# EAGLE design Lifting Mechanism (EAGLE 7.2.0)
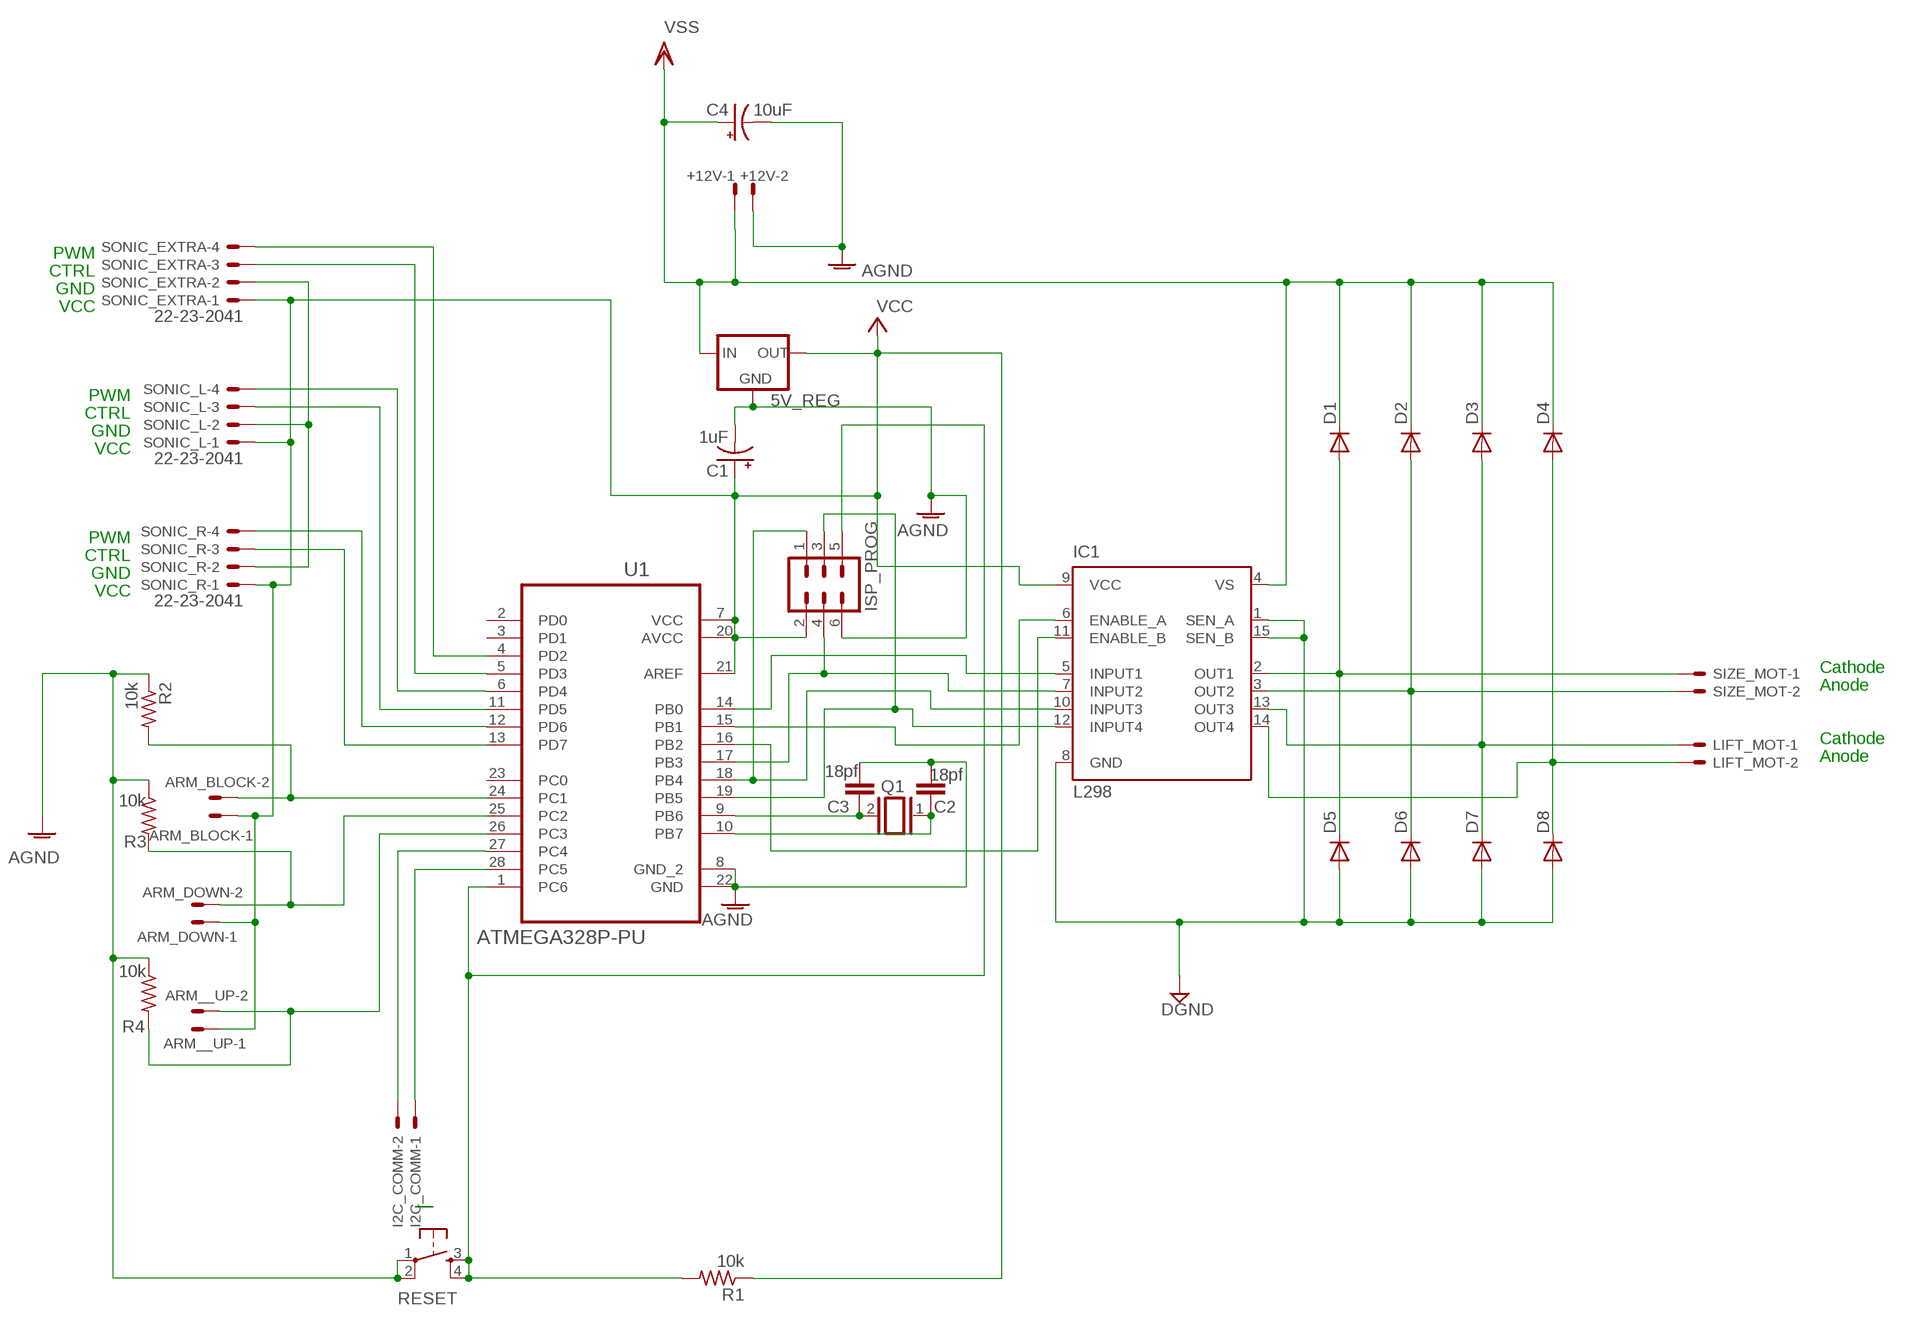
[diagram p0: schematic, sheet 1]

## Parts
5V_REG  V_REG_78XXSINK  [TO220-IGO]
+12V  22-23-2021  [22-23-2021]
ARM__UP  22-23-2021  [22-23-2021]
ARM_BLOCK  22-23-2021  [22-23-2021]
ARM_DOWN  22-23-2021  [22-23-2021]
C1  1uF  CPOL-USE2.5-5  [E2,5-5]
C2  18pf  C2,5-3  [C2.5-3]
C3  18pf  C2,5-3  [C2.5-3]
C4  10uF  CPOL-USE2.5-5  [E2,5-5]
D1  DIODE1N4148  [DIODE-1N4148]
D2  DIODE1N4148  [DIODE-1N4148]
D3  DIODE1N4148  [DIODE-1N4148]
D4  DIODE1N4148  [DIODE-1N4148]
D5  DIODE1N4148  [DIODE-1N4148]
D6  DIODE1N4148  [DIODE-1N4148]
D7  DIODE1N4148  [DIODE-1N4148]
D8  DIODE1N4148  [DIODE-1N4148]
I2C_COMM  22-23-2021  [22-23-2021]
IC1  L298  [MULTIWATT-15]
ISP_PROG  MA03-2  [MA03-2]
LIFT_MOT  22-23-2021  [22-23-2021]
Q1  XTAL/S  [QS]
R1  10k  R-US_0207/7  [0207/7]
R2  10k  R-US_0207/7  [0207/7]
R3  10k  R-US_0207/7  [0207/7]
R4  10k  R-US_0207/7  [0207/7]
RESET  TAC_SWITCHPTH  [TACTILE-PTH]
SIZE_MOT  22-23-2021  [22-23-2021]
SONIC_EXTRA  22-23-2041  [22-23-2041]
SONIC_L  22-23-2041  [22-23-2041]
SONIC_R  22-23-2041  [22-23-2041]
U1  ATMEGA328P-PU  [DIP254P762X457-28]

## Nets
GND: 5V_REG.GND +12V.2 C1.- C2.2 C3.2 C4.- D5.A D6.A D7.A D8.A IC1.1(SEN_A) IC1.8(GND) IC1.15(SEN_B) ISP_PROG.6 R2.1 R3.1 R4.1 RESET.1 RESET.2 U1.8(GND_2) U1.22(GND) ; supply symbol labelled DGND, AGND
N$1: ARM_BLOCK.2 R2.2 U1.24(PC1)
N$2: ARM_DOWN.2 R3.2 U1.25(PC2)
N$3: I2C_COMM.1 U1.28(PC5)
N$4: C3.1 Q1.2 U1.9(PB6)
N$5: IC1.5(INPUT1) U1.14(PB0)
N$6: D2.A D6.C IC1.3(OUT2) SIZE_MOT.2
N$7: I2C_COMM.2 U1.27(PC4)
N$8: D4.A D8.C IC1.14(OUT4) LIFT_MOT.2
N$9: C2.1 Q1.1 U1.10(PB7)
N$10: ARM__UP.2 R4.2 U1.26(PC3)
N$12: SONIC_R.3 U1.13(PD7)
N$13: SONIC_EXTRA.2 SONIC_L.2 SONIC_R.2
N$14: SONIC_R.4 U1.12(PD6)
N$15: SONIC_L.3 U1.11(PD5)
N$16: SONIC_L.4 U1.6(PD4)
N$17: SONIC_EXTRA.3 U1.5(PD3)
N$18: ISP_PROG.5 R1.2 RESET.3 RESET.4 U1.1(PC6)
N$19: SONIC_EXTRA.4 U1.4(PD2)
N$20: D3.A D7.C IC1.13(OUT3) LIFT_MOT.1
N$22: IC1.10(INPUT3) ISP_PROG.1 U1.18(PB4)
N$23: IC1.6(ENABLE_A) U1.15(PB1)
N$24: IC1.11(ENABLE_B) U1.16(PB2)
N$25: IC1.7(INPUT2) ISP_PROG.4 U1.17(PB3)
N$27: IC1.12(INPUT4) ISP_PROG.3 U1.19(PB5)
N$34: D1.A D5.C IC1.2(OUT1) SIZE_MOT.1
VCC: 5V_REG.OUT ARM__UP.1 ARM_BLOCK.1 ARM_DOWN.1 C1.+ IC1.9(VCC) ISP_PROG.2 R1.1 SONIC_EXTRA.1 SONIC_L.1 SONIC_R.1 U1.7(VCC) U1.20(AVCC) U1.21(AREF)
VSS: 5V_REG.IN +12V.1 C4.+ D1.C D2.C D3.C D4.C IC1.4(VS)
Unconnected: U1.2(PD0) U1.3(PD1) U1.23(PC0)

## Notes on the sheet
- PWM
- CTRL
- GND
- VCC
- PWM
- CTRL
- GND
- VCC
- PWM
- CTRL
- GND
- VCC
- Cathode
- Anode
- Cathode
- Anode

## Library data of the parts
5V_REG = SparkFun:V_REG_78XX: Voltage Regulator Standard 7805 5V regulator. IGO (Input Ground Output). Spark Fun Electronics SKU : COM-00107
+12V ARM__UP ARM_BLOCK ARM_DOWN I2C_COMM LIFT_MOT SIZE_MOT = TRF7960ATB_BreakoutBoard:22-23-2021: .100" (2.54mm) Center Header - 2 Pin
C1 C4 = rcl:CPOL-US: POLARIZED CAPACITOR, American symbol
C2 C3 = capacitor-wima:C: CAPACITOR naming: grid - package width
D1-D8 = SparkFun:DIODE: Diode These are standard reverse protection diodes and small signal diodes. SMA package can handle up to about 1A. SOD-323 can handle about 200mA. What the SOD-323 package when ordering, there are some mfgs out there that are 5-pin packages.
IC1 = st-microelectronics:L298: DUAL FULL-BRIDGE DRIVER; MPN: L298N; OC_FARNELL: 1589425; OC_NEWARK: 32M1527
ISP_PROG = con-lstb:MA03-2: PIN HEADER; OC_FARNELL: unknown; OC_NEWARK: unknown
Q1 = special:XTAL/S: CRYSTAL
R1-R4 = rcl:R-US_: RESISTOR, American symbol
RESET = SparkFun:TAC_SWITCH: Momentary Switch Button commonly used for reset or general input. Spark Fun Electronics SKU : COM-00097
SONIC_EXTRA SONIC_L SONIC_R = TRF7960ATB_BreakoutBoard:22-23-2041: .100" (2.54mm) Center Header - 4 Pin
U1 = Atmel_By_element14_Batch_1-00:ATMEGA328P-PU: 8-bit Microcontroller with In-System Programmable Flash; MPN: ATMEGA328P-PU; OC_FARNELL: 1715487; OC_NEWARK: 15R0268; PACKAGE: PDIP-28; SUPPLIER: Atmel

## Board
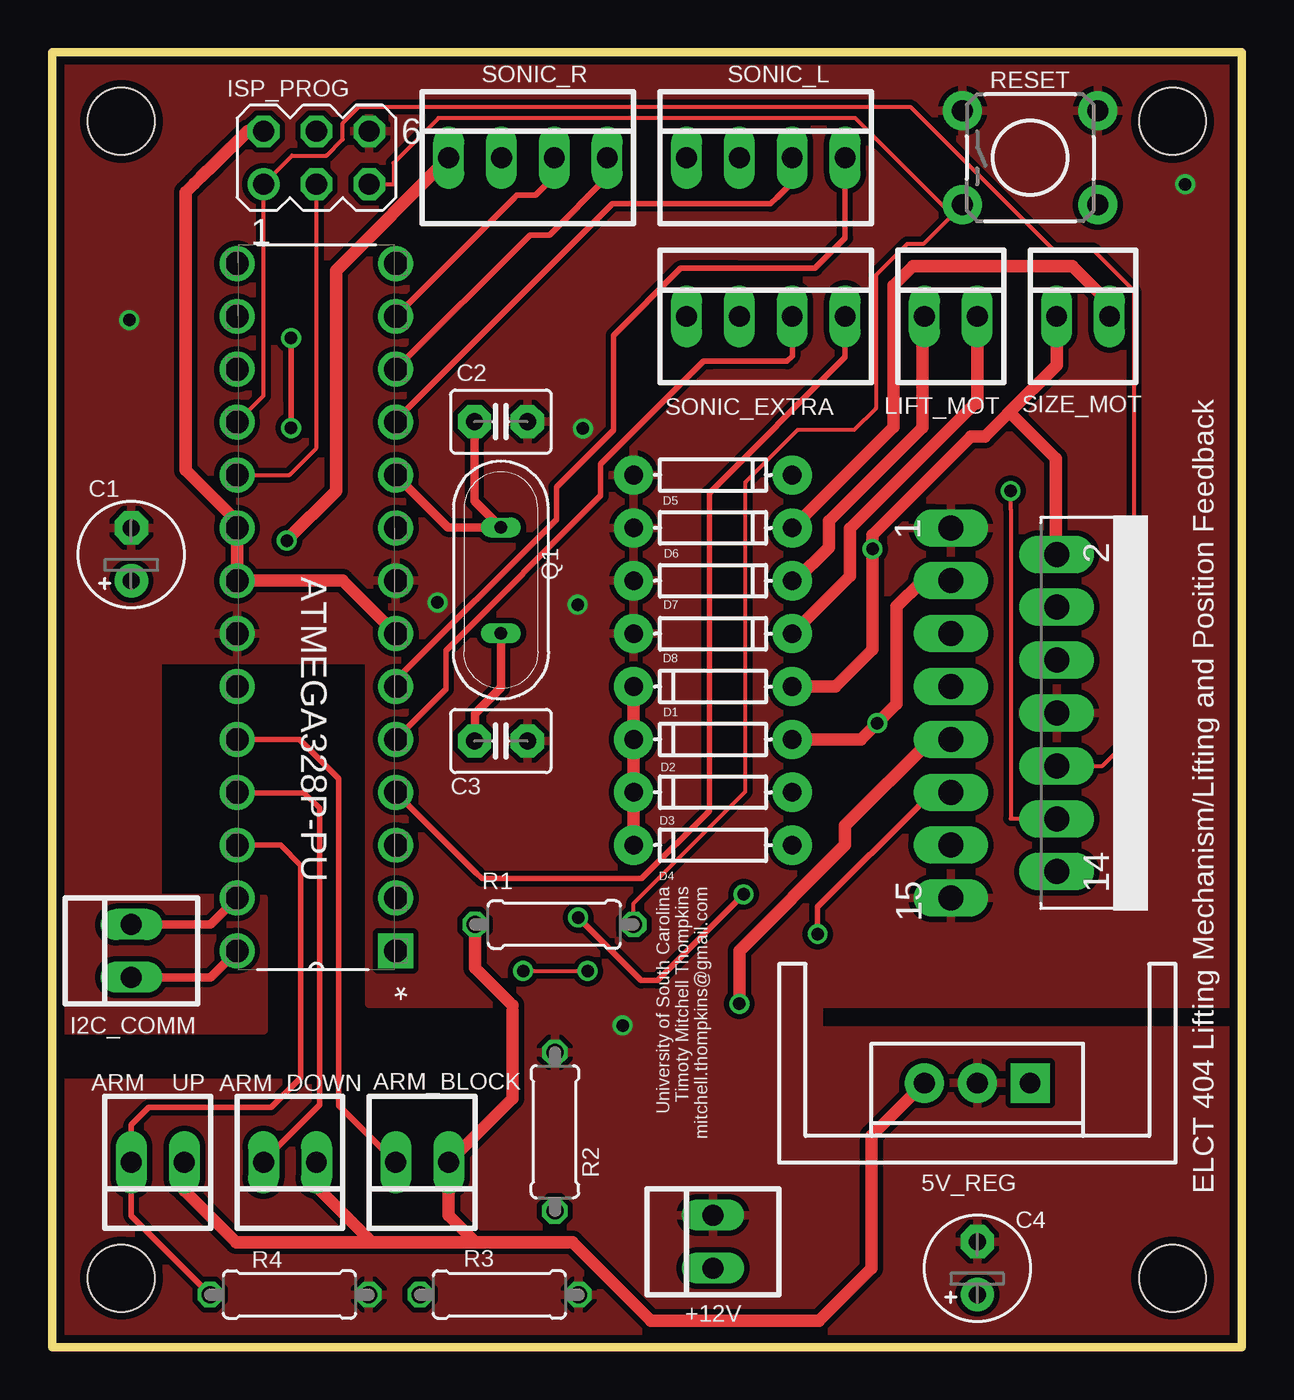
[diagram p1: board, top side]
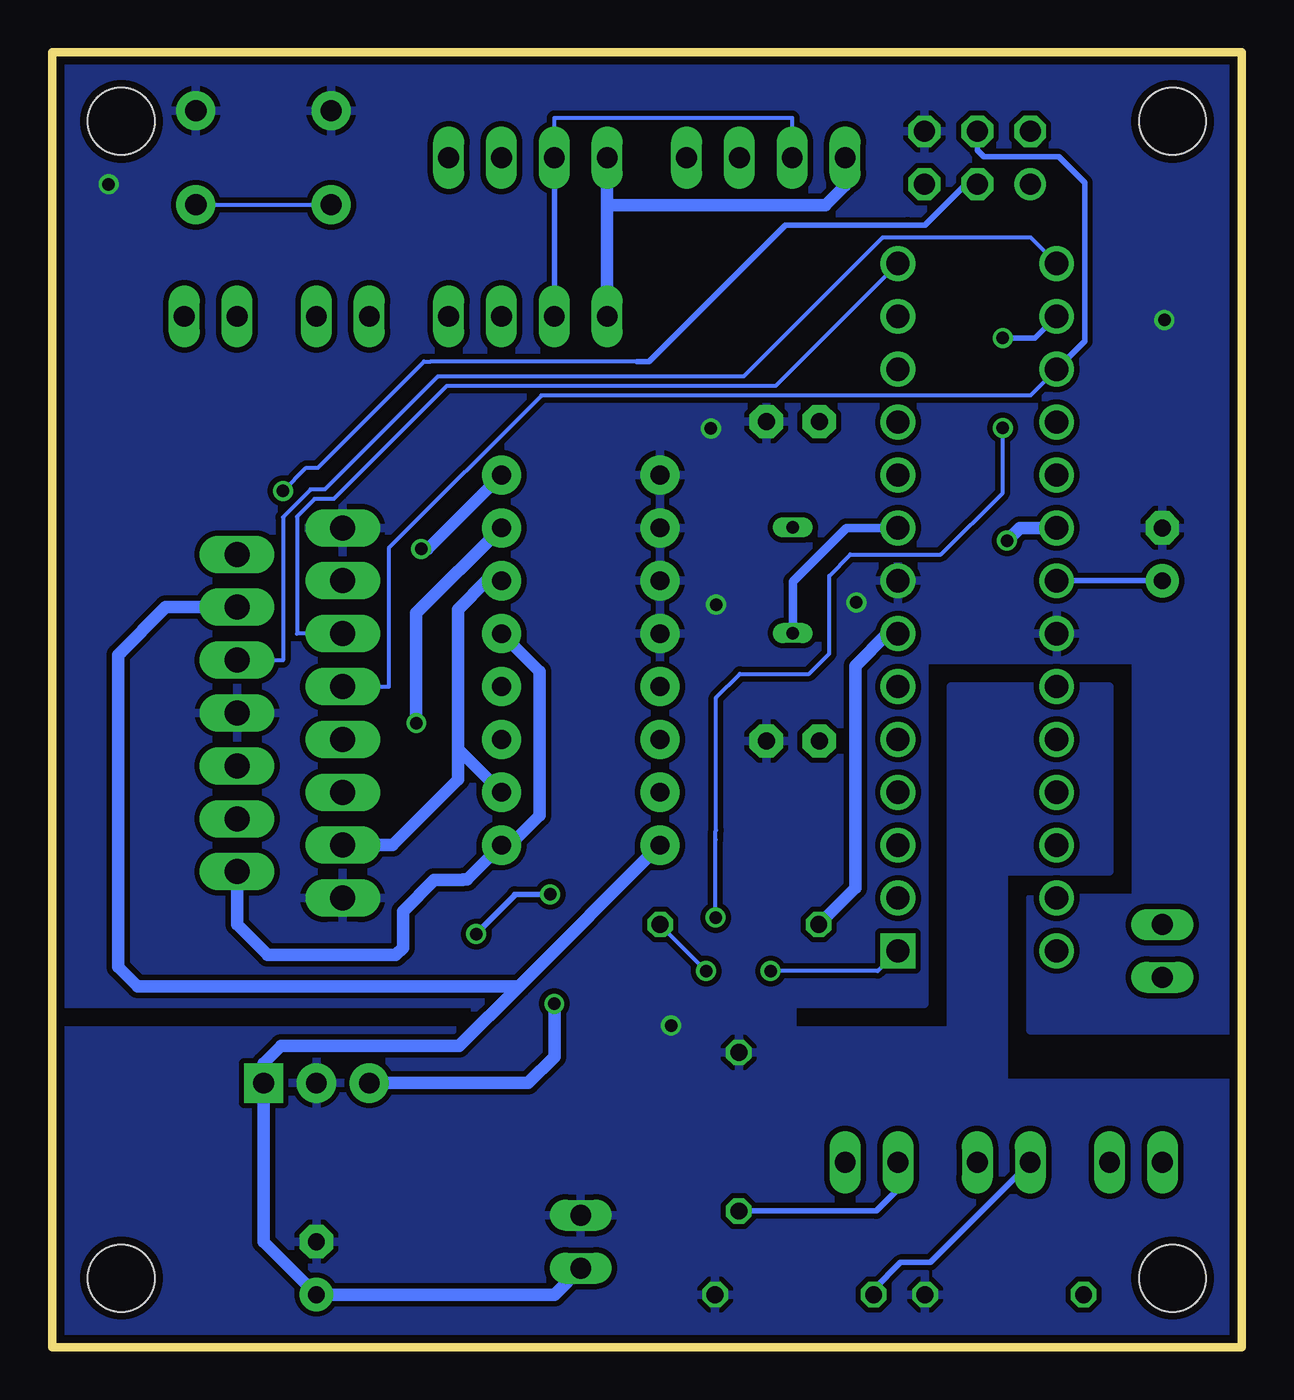
[diagram p2: board, bottom side, seen from below]

Size 57.15 x 62.23 mm. Coordinates in mm from the lower left corner, seen from the top.
Outline: 0,62.23 57.15,62.23 57.15,17.17 57.15,16.51 57.15,15.24 57.15,15.21 57.15,0 0,0 0,12.37 0,12.7 0,15.24 0,15.37 0,62.23
Copper layers (1*16): Top 0.0356mm / dielectric 1.5011mm / Bottom 0.0356mm
Design rules "Oshpark *": minimum track width 8mil, minimum drill 13mil, track to track 10mil, track to pad 12mil, pad to pad 12mil, via to via 10mil, smd to smd 6mil, copper to edge 15mil, drill to drill 6mil, minimum pad ring 7mil, minimum via ring 7mil, stop-mask expansion 3mil, vias tented up to drill 0mil, thermal gap 10mil
Holes 3.2 mm at 3.33,58.9 53.82,58.9 53.82,3.33 3.33,3.33

### Footprints (pad centres in the part's own frame; a part is rotated, then mirrored left to right if it is on the bottom)
TO220-IGO = drill 1 pad 1.88: GND 0,0; OUT 2.54,0 | drill 1 pad 1.88 square: IN -2.54,0
22-23-2021 = drill 1 long: 1 -1.27,0; 2 1.27,0
E2,5-5 = drill 0.813 pad 1.6: + -1.27,0 | drill 0.813 pad 1.6 octagon: - 1.27,0
C2.5-3 = drill 0.813 pad 1.6 octagon: 1 -1.27,0; 2 1.27,0
DIODE-1N4148 = drill 0.9 pad 1.88: A -3.81,0; C 3.81,0
MULTIWATT-15 = drill 1.2 long: 1 -8.89,-7.62; 2 -7.62,-2.54; 3 -6.35,-7.62; 4 -5.08,-2.54; 5 -3.81,-7.62; 6 -2.54,-2.54; 7 -1.27,-7.62; 8 0,-2.54; 9 1.27,-7.62; 10 2.54,-2.54; 11 3.81,-7.62; 12 5.08,-2.54; 13 6.35,-7.62; 14 7.62,-2.54; 15 8.89,-7.62
MA03-2 = drill 1.016: 1 -2.54,-1.27 | drill 1.016 octagon: 2 -2.54,1.27; 3 0,-1.27; 4 0,1.27; 5 2.54,-1.27; 6 2.54,1.27
QS = drill 0.61 long: 1 -2.54,0; 2 2.54,0
0207/7 = drill 0.813 octagon: 1 -3.81,0; 2 3.81,0
TACTILE-PTH = drill 1.016 pad 1.88: 1 -3.251,2.261; 2 3.251,2.261; 3 -3.251,-2.261; 4 3.251,-2.261
22-23-2041 = drill 1 long: 1 -3.81,0; 2 -1.27,0; 3 1.27,0; 4 3.81,0
DIP254P762X457-28 = drill 1.118 square: 1 -7.62,33.02 | drill 1.118: 2 -7.62,30.48; 3 -7.62,27.94; 4 -7.62,25.4; 5 -7.62,22.86; 6 -7.62,20.32; 7 -7.62,17.78; 8 -7.62,15.24; 9 -7.62,12.7; 10 -7.62,10.16; 11 -7.62,7.62; 12 -7.62,5.08; 13 -7.62,2.54; 14 -7.62,0; 15 0,0; 16 0,2.54; 17 0,5.08; 18 0,7.62; 19 0,10.16; 20 0,12.7; 21 0,15.24; 22 0,17.78; 23 0,20.32; 24 0,22.86; 25 0,25.4; 26 0,27.94; 27 0,30.48; 28 0,33.02

### Placement (x,y rotation side)
5V_REG  44.45,12.7 180 top
+12V  31.75,5.08 90 top
ARM__UP  5.08,8.89 180 top
ARM_BLOCK  17.78,8.89 180 top
ARM_DOWN  11.43,8.89 180 top
C1  3.81,38.1 90 top
C2  21.56,44.48 0 top
C3  21.56,29.13 0 top
C4  44.45,3.81 90 top
D1  31.75,31.75 180 top
D2  31.75,29.21 180 top
D3  31.75,26.67 180 top
D4  31.75,24.13 180 top
D5  31.75,41.91 0 top
D6  31.75,39.37 0 top
D7  31.75,36.83 0 top
D8  31.75,34.29 0 top
I2C_COMM  3.81,19.05 90 top
IC1  50.8,30.48 270 top
ISP_PROG  12.7,57.15 0 top
LIFT_MOT  43.18,49.53 0 top
Q1  21.56,36.86 270 top
R1  24.13,20.32 0 top
R2  24.16,10.36 270 top
R3  21.49,2.54 180 top
R4  11.4,2.54 180 top
RESET  46.99,57.15 0 top
SIZE_MOT  49.53,49.53 0 top
SONIC_EXTRA  34.29,49.53 0 top
SONIC_L  34.29,57.15 0 top
SONIC_R  22.86,57.15 0 top
U1  8.89,52.07 180 top

### Tracks (layer width: path | path; a pad name or v marks a point on that pad's centre or on a via)
GND  (via drill 0.6 pad 0.69)
  other vias: 25.5,44.15 3.71,49.35 27.41,15.47 54.43,55.88 18.52,35.79 25.25,35.69
  pour Top: 0,12.7 11.43,12.7 11.43,22.86 6.35,22.86 6.35,31.75 13.97,31.75 13.97,15.24 21.59,15.24 21.59,16.51 15.24,16.51 15.24,33.02 5.08,33.02 5.08,21.59 10.16,21.59 10.16,15.24 0,15.24 0,62.23 57.15,62.23 57.15,16.51 36.83,16.51 36.83,15.24 57.15,15.24 57.15,0 0,0
  pour Bottom: 0,12.7 11.43,12.7 11.43,22.86 6.35,22.86 6.35,31.75 13.97,31.75 13.97,15.24 21.59,15.24 21.59,16.51 15.24,16.51 15.24,33.02 5.08,33.02 5.08,21.59 10.16,21.59 10.16,15.24 0,15.24 0,62.23 57.15,62.23 57.15,16.51 36.83,16.51 36.83,15.24 57.15,15.24 57.15,0 0,0
N$1
  Top 0.254: ARM_BLOCK.2 13.77,11.63 13.77,27.33 11.89,29.21 U1.24
  Bottom 0.254: ARM_BLOCK.2 16.48,8.87 16.48,7.62 17.55,6.55 R2.2
N$2
  Top 0.254: U1.25 8.89,26.64 12.12,26.64 12.85,25.91 12.85,11.66 10.16,8.97 ARM_DOWN.2
  Bottom 0.254: ARM_DOWN.2 14.96,4.09 16.38,4.09 17.68,2.79 R3.2
N$3
  Top 0.406: I2C_COMM.1 7.62,17.78 U1.28
N$4
  Top 0.406: C3.1 20.32,29.16 20.32,30.45 21.57,31.7 Q1.2
  Bottom 0.406: U1.9 19,39.37 21.57,36.8 Q1.2 21.54,34.29
N$5
  Bottom 0.203: U1.14 22.39,46.19 38.19,46.19 43.62,40.76 44.54,40.76 45.39,39.91 45.39,34.29 IC1.5
N$6  (via drill 0.6 pad 0.69)
  Top 0.61: D6.C 40.41,44.22 40.41,51 41.35,51.94 49.02,51.94 50.8,50.16 SIZE_MOT.2 | IC1.3 43.16,36.8 41.78,36.8 40.56,35.59 40.56,30.91 v39.65,30 38.86,29.21 D2.A
  Bottom 0.61: D6.C 39.65,35.28 v39.65,30
N$7
  Top 0.406: I2C_COMM.2 7.62,20.32 U1.27
N$8
  Top 0.61: LIFT_MOT.2 44.45,45.36 44.35,45.36 38.33,39.34 38.33,39.12 38.33,37.06 D8.C
  Bottom 0.61: IC1.14 48.26,20.32 46.79,18.85 40.64,18.85 40.28,19.2 40.28,20.95 38.79,22.45 37.44,22.45 37.41,22.48 37.21,22.48 D4.A 35.15,24.13 33.73,25.55 33.73,32.46 D8.C
N$9
  Top 0.406: U1.10 19.02,39.4 Q1.1 20.3,40.66 C2.1
N$10
  Top 0.254: U1.26 10.97,24.13 11.94,23.16 11.94,12.95 10.52,11.53 4.65,11.53 3.81,10.69 ARM__UP.2 3.81,6.33 R4.2
N$12
  Top 0.254: U1.13 22.22,55.24 22.33,55.35 23.22,55.35 24.13,56.26 SONIC_R.3
N$13
  Bottom 0.203: SONIC_L.2 33.02,59.06 21.59,59.06 SONIC_R.2
  Bottom 0.254: SONIC_L.2 SONIC_EXTRA.2
N$14
  Top 0.254: U1.12 22.96,53.44 23.9,53.44 26.67,56.21 SONIC_R.4
N$15
  Top 0.203: U1.11 16.52,44.45
  Top 0.254: SONIC_L.3 35.59,57.12 35.59,56.01 34.82,55.24 34.52,54.94 26.92,54.94 16.51,44.53 U1.11
N$16
  Top 0.254: 24.23,40.76 24.23,40.54 | 24.23,40.54 24.23,39.78 16.51,32.05 U1.6 | 24.23,40.54 24.23,41.33 26.98,44.07 26.98,48.62 30.2,51.84 32.94,51.84 36.65,51.84 38.1,53.29 SONIC_L.4
N$17
  Top 0.254: SONIC_EXTRA.3 35.56,47.62 35.31,47.37 31.67,47.37 31.5,47.37 31.29,47.37 26.36,42.44 26.36,42.14 | U1.5 18.92,31.62 18.92,33.48 26.36,40.92 26.36,42.14 | 26.36,42.14 26.36,42.23
N$18  (via drill 0.6 pad 0.69)
  Top 0.203: 43.24,54.4 RESET.3 | 43.24,54.4 38.58,59.06 18.57,59.06 16.41,56.9 16.41,55.88 ISP_PROG.5 | R1.2 27.94,21.34 33.31,26.71 33.31,41.57 35.81,44.07 38.53,44.07 39.57,45.11 39.57,51.51 41.07,53.01 41.86,53.01 43.24,54.4 | v22.63,18.09 v25.73,18.09
  Bottom 0.203: RESET.4 RESET.3 | U1.1 17.48,18.09 v22.63,18.09 | v25.73,18.09 27.94,20.3 R1.2
N$19
  Top 0.254: SONIC_EXTRA.4 38.1,47.62 38.1,47.57 31.57,41.05 31.57,25.78 28.32,22.53 20.65,22.53 20.4,22.78 U1.4
N$20
  Top 0.61: LIFT_MOT.1 41.81,49.43 41.81,44.2 37.31,39.7 37.31,38.43 35.71,36.83 D7.C
  Bottom 0.61: IC1.13 40.79,24.13 37.64,27.28 37.64,28.75 | D3.A 37.64,28.75 | 37.64,28.75 37.64,34.44 37.64,35.46 36.27,36.83 D7.C
N$22
  Top 0.203: U1.18 10.16,45.72 ISP_PROG.1 11.53,57.25 13.19,57.25 13.97,58.03 13.97,58.81 14.75,59.59 41.23,59.59 48.09,52.73 49.99,52.73 51.96,50.76 51.96,29.43 50.47,27.94 IC1.10
N$23
  Bottom 0.203: U1.15 10.13,53.31 17.26,53.31 23.93,46.64 38.62,46.64 44.05,41.21 44.73,41.21 46.05,39.89 46.05,33.02 IC1.6
N$24  (via drill 0.6 pad 0.69)
  Top 0.254: v11.48,48.49 11.48,45.52 v11.48,44.17 | v33.22,21.77 29.08,17.63 28.3,17.63 v25.27,20.65 | v36.78,19.86 36.78,21.16 41.86,26.24 42.29,26.67 IC1.11
  Bottom 0.203: v25.27,20.65 25.27,24.38 25.27,24.82 25.25,24.84 25.25,31.22 24.11,32.36 20.78,32.36 19.81,33.33 19.81,37.06 18.8,38.1 14.45,38.1 11.48,41.05 v11.48,44.17
  Bottom 0.254: U1.16 9.93,48.49 v11.48,48.49 | v33.22,21.77 34.92,21.77 34.92,21.72 v36.78,19.86
N$25
  Bottom 0.203: IC1.7 40.97,31.75 40.97,38.4 33.65,45.73 10.15,45.73 U1.17
  Bottom 0.254: U1.17 7.54,48.34 7.54,55.96 8.79,57.2 12.39,57.2 12.7,57.51 ISP_PROG.4
N$27  (via drill 0.6 pad 0.69)
  Top 0.203: IC1.12 46.05,25.4 46.05,40.27 v46.05,41.15 | U1.19 11.4,41.91 12.7,43.2 ISP_PROG.3 12.7,55.63
  Bottom 0.203: 28.48,47.36 29.06,47.36 38.96,47.36 39.28,47.36 44.37,42.27 44.93,42.27 v46.05,41.15
  Bottom 0.254: 28.53,47.36 29.06,47.36 | 28.48,47.36 21.92,53.92 16.05,53.92 15.21,53.92 13.26,55.88 ISP_PROG.3
N$34  (via drill 0.6 pad 0.69)
  Top 0.406: 46.1,44.84 45.89,44.84
  Top 0.61: v39.42,38.36 39.47,38.41 v39.42,38.36 | SIZE_MOT.1 48.26,48.46 48.26,47.2 45.89,44.84 44.82,43.76 44.15,43.76 39.42,39.04 v39.42,38.36 | IC1.2 48.23,38.12 48.23,42.7 46.1,44.84 | v39.42,38.36 39.42,37.97 39.42,37.96 | D1.A 37.64,31.75 39.42,33.52 v39.42,38.36
  Bottom 0.61: D5.C 39.11,38.36 v39.42,38.36
VCC  (via drill 0.6 pad 0.69)
  Top 0.203: 22.12,16.18 22.12,16.43
  Top 0.61: U1.7 13.97,36.83 U1.21 U1.20 8.89,39.67 6.43,42.14 6.43,55.5 6.83,55.91 7.17,56.24 7.81,56.86 9.4,58.42 ISP_PROG.2 | R1.1 20.32,19.3 20.32,18.24 22.12,16.43 | 5V_REG.OUT 39.37,10.16 39.37,3.81 36.83,1.27 29.21,1.27 28.78,1.27 24.99,5.05 20.34,5.05 | v33.02,16.51 33.02,19.05 38.1,24.13 38.1,25.07 42.24,29.21 IC1.9 | 22.12,16.18 22.12,11.96 22.1,11.94 ARM_BLOCK.1 19.05,6.88 19.05,6.35 20.34,5.05 | ARM_DOWN.1 12.72,8.87 12.72,7.7 15.37,5.05 15.42,5.05 | 15.42,5.05 20.34,5.05 | ARM__UP.1 6.38,8.87 6.38,7.52 8.84,5.05 15.42,5.05 | SONIC_R.1 13.64,51.74 13.64,42.14 13.64,41.15 11.28,38.79 v11.28,38.76
  Bottom 0.254: U1.21 C1.+
  Bottom 0.61: SONIC_EXTRA.1 30.48,51.44 30.48,54.28 30.48,54.86 | v33.02,16.51 33.02,13.97 34.29,12.7 5V_REG.OUT | 30.48,54.86 30.48,55.19 SONIC_L.1 | R1.1 18.57,22.07 18.57,32.74 17.02,34.29 U1.7 | SONIC_R.1 19.05,55.8 19.99,54.86 30.48,54.86 | v11.28,38.76 10.67,39.37 U1.20
VSS
  Top 0.61: D1.C D2.C D3.C D4.C
  Bottom 0.61: +12V.1 33.02,2.54 C4.+ 46.99,5.08 5V_REG.IN 46.99,13.64 46.15,14.48 45.39,14.48 37.59,14.48 34.72,17.35 | D4.C 34.72,17.35 | IC1.4 51.69,35.56 53.98,33.27 53.98,18.29 53.03,17.35 34.72,17.35

### Text on the board
tNames: University of South Carolina / Timoty Mitchell Thompkins / mitchell.thompkins@gmail.com | ELCT 404 Lifting Mechanism/Lifting and Position Feedback